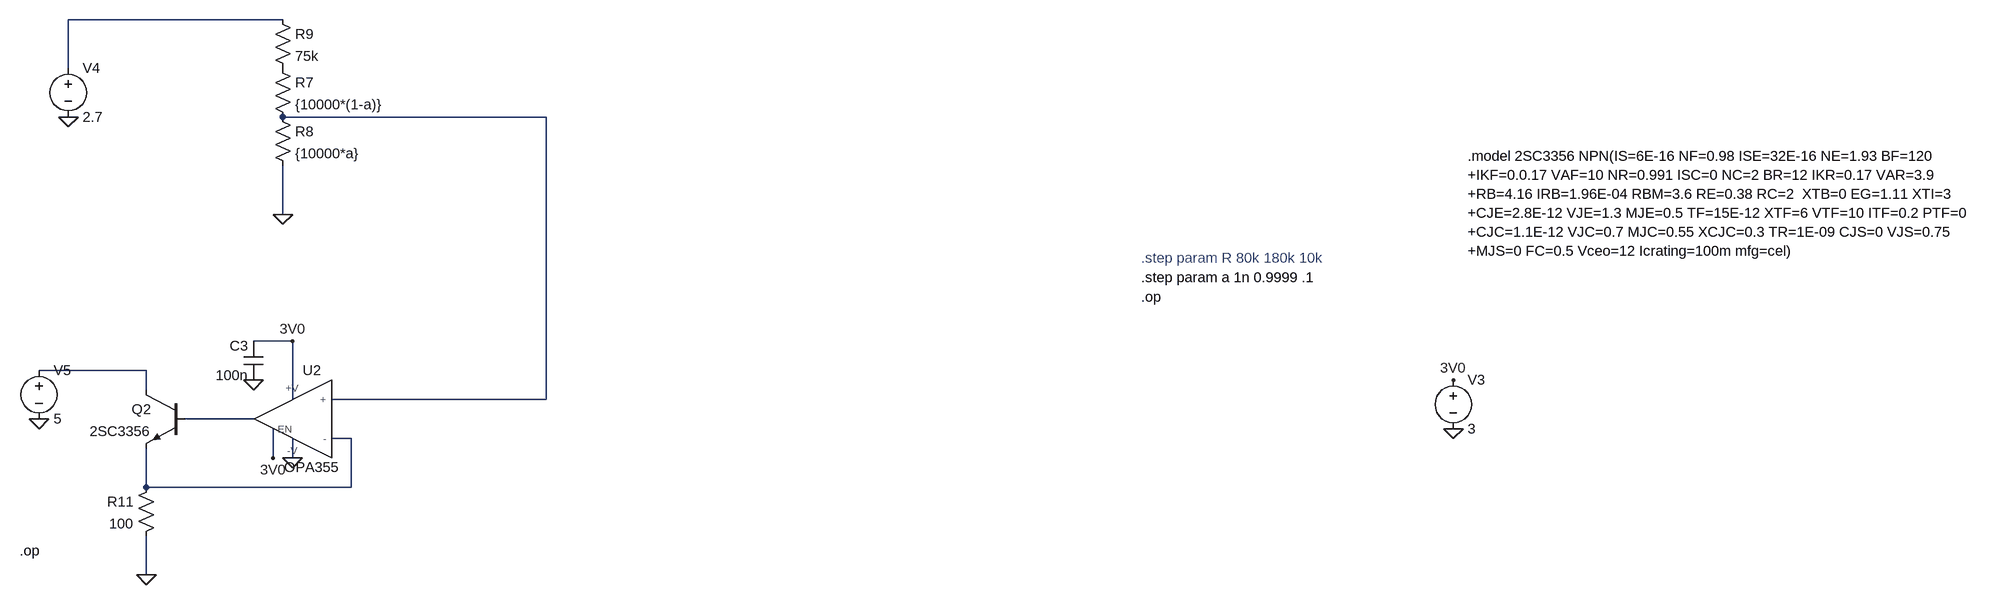
[diagram p0: schematic sweep_bias_demo.asc]
sweep_bias_demo.asc, the LTspice schematic file:
Version 4
SHEET 1 1312 680
WIRE -1520 -384 -1872 -384
WIRE -1872 -304 -1872 -384
WIRE -1088 -224 -1520 -224
WIRE -1520 -64 -1520 -144
WIRE -1504 144 -1568 144
WIRE -1744 192 -1920 192
WIRE -1744 224 -1744 192
WIRE -1504 240 -1504 144
WIRE -1088 240 -1088 -224
WIRE -1088 240 -1440 240
WIRE -1568 272 -1680 272
WIRE -1408 304 -1440 304
WIRE -1536 336 -1536 288
WIRE -1504 336 -1504 304
WIRE -1744 384 -1744 320
WIRE -1408 384 -1408 304
WIRE -1408 384 -1744 384
WIRE -1744 528 -1744 464
FLAG 400 288 0
FLAG 400 208 3V0
FLAG -1872 -224 0
FLAG -1520 -64 0
FLAG -1504 336 0
FLAG -1568 208 0
FLAG -1536 336 3V0
FLAG -1504 144 3V0
FLAG -1920 272 0
FLAG -1744 528 0
SYMBOL voltage 400 192 R0
WINDOW 123 0 0 Left 0
WINDOW 39 0 0 Left 0
SYMATTR InstName V3
SYMATTR Value 3
SYMBOL voltage -1872 -320 R0
WINDOW 123 0 0 Left 0
WINDOW 39 0 0 Left 0
SYMATTR InstName V4
SYMATTR Value 2.7
SYMBOL res -1536 -320 R0
SYMATTR InstName R7
SYMATTR Value {10000*(1-a)}
SYMBOL res -1536 -240 R0
SYMATTR InstName R8
SYMATTR Value {10000*a}
SYMBOL res -1728 368 M0
SYMATTR InstName R11
SYMATTR Value 100
SYMBOL cap -1552 144 M0
SYMATTR InstName C3
SYMATTR Value 100n
SYMBOL OPA355 -1472 272 M0
SYMATTR InstName U2
SYMBOL npn -1680 224 M0
SYMATTR InstName Q2
SYMATTR Value 2SC3356
SYMBOL voltage -1920 176 R0
WINDOW 123 0 0 Left 0
WINDOW 39 0 0 Left 0
SYMATTR InstName V5
SYMATTR Value 5
SYMBOL res -1536 -400 R0
SYMATTR InstName R9
SYMATTR Value 75k
TEXT 424 -160 Left 2 !.model 2SC3356 NPN(IS=6E-16 NF=0.98 ISE=32E-16 NE=1.93 BF=120 \n+IKF=0.0.17 VAF=10 NR=0.991 ISC=0 NC=2 BR=12 IKR=0.17 VAR=3.9 \n+RB=4.16 IRB=1.96E-04 RBM=3.6 RE=0.38 RC=2  XTB=0 EG=1.11 XTI=3 \n+CJE=2.8E-12 VJE=1.3 MJE=0.5 TF=15E-12 XTF=6 VTF=10 ITF=0.2 PTF=0 \n+CJC=1.1E-12 VJC=0.7 MJC=0.55 XCJC=0.3 TR=1E-09 CJS=0 VJS=0.75 \n+MJS=0 FC=0.5 Vceo=12 Icrating=100m mfg=cel)
TEXT -112 40 Left 2 !.step param a 1n 0.9999 .1
TEXT -112 72 Left 2 !.op
TEXT -1952 488 Left 2 !.op
TEXT -112 8 Left 2 ;.step param R 80k 180k 10k

The netlist it stands for:
* sweep_bias_demo.asc
V3 3V0 0 3
V4 N001 0 2.7
R7 P001 N002 {10000*(1-a)}
R8 N002 0 {10000*a}
R11 N005 0 100
C3 3V0 0 100n
XU2 N004 0 N002 N005 3V0 3V0 OPA355  ; pins OUT -V + - EN +V
Q2 N003 N004 N005 0 2SC3356
V5 N003 0 5
R9 N001 P001 75k
.model NPN NPN
.model PNP PNP
.lib standard.bjt
.model 2SC3356 NPN(IS=6E-16 NF=0.98 ISE=32E-16 NE=1.93 BF=120
+IKF=0.0.17 VAF=10 NR=0.991 ISC=0 NC=2 BR=12 IKR=0.17 VAR=3.9
+RB=4.16 IRB=1.96E-04 RBM=3.6 RE=0.38 RC=2  XTB=0 EG=1.11 XTI=3
+CJE=2.8E-12 VJE=1.3 MJE=0.5 TF=15E-12 XTF=6 VTF=10 ITF=0.2 PTF=0
+CJC=1.1E-12 VJC=0.7 MJC=0.55 XCJC=0.3 TR=1E-09 CJS=0 VJS=0.75
+MJS=0 FC=0.5 Vceo=12 Icrating=100m mfg=cel)
.step param a 1n 0.9999 .1
.op
.op
* .step param R 80k 180k 10k
.lib OPA355.LIB
.backanno
.end